# Altium schematic sheet main.SchDoc
size C; SheetNumber: 1; SheetTotal: 1
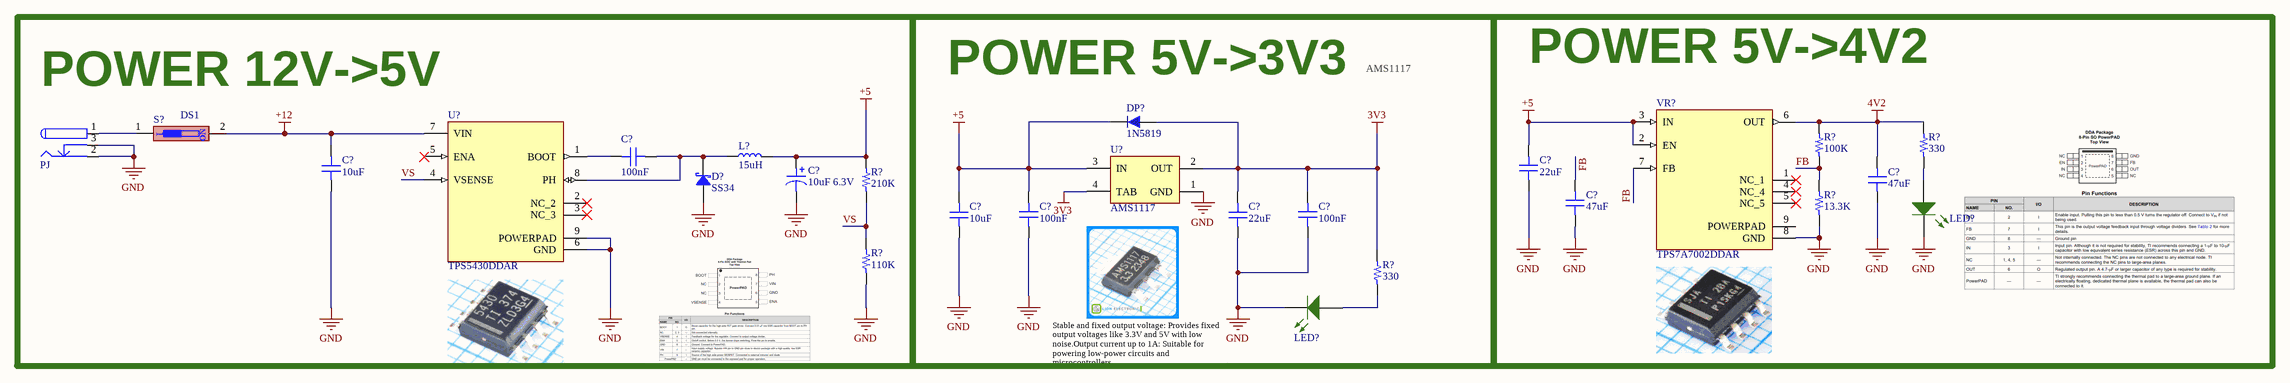
[diagram p0: main.SchDoc]

## Parts
(Parts that share a designator on the sheet are numbered #1, #2 ... from top to bottom, then left to right.)
C?#1  100nF  [CAP 0805_2012]
C?#2  10uF  [CAP 0805_2012]
C?#3  22uF  [CAP 0805_2012]
C?#4  10uF 6.3V  [CAP ALSMD POLY 8.3MM H12.0MM]
C?#5  47uF  [CAP 0805_2012]
C?#6  47uF  [CAP 0805_2012]
C?#7  10uF  [CAP 0805_2012]
C?#8  100nF  [CAP 0805_2012]
C?#9  22uF  [CAP 0805_2012]
C?#10  100nF  [CAP 0805_2012]
D?  SS34  [DO-214AC SMA]
DP?  1N5819  [430X270D]
L?  15uH  [IND 12X12MM]
LED?#1  LED SMD 0805 GREEN  [LED_0805_GREEN]  (value not drawn)
LED?#2  LED SMD 0805 GREEN  [LED_0805_GREEN]  (value not drawn)
PJ  DC Power Jack  [DC Power Jack 1]  (value not drawn)
R?#1  100K  [RES 0805_2012]
R?#2  330  [RES 0805_2012]
R?#3  210K  [RES 0805_2012]
R?#4  13.3K  [RES 0805_2012]
R?#5  110K  [RES 0805_2012]
R?#6  330  [RES 0805_2012]
S?  DS1  [DIP Switch x1]
U?#1  AMS1117  [SOT223_M]
U?#2  TPS5430DDAR  [CONV_TPS5430DDAR]
VR?  TPS7A7002DDAR  [VREG_TPS7A7002DDAR]

## Blocks framed on the sheet
POWER 12V->5V: C?#1 C?#2 C?#4 D? L? PJ R?#3 R?#5 S? U?#2
POWER 5V->3V3: C?#7-C?#10 DP? LED?#2 R?#6 U?#1
POWER 5V->4V2: C?#3 C?#5 C?#6 LED?#1 R?#1 R?#2 R?#4 VR?

## Nets
3V3: C?#9.2 C?#10.1 DP?.1 R?#6.1 U?#1.2(OUT) U?#1.4(TAB)
4V2: C?#5.1 R?#1.1 R?#2.1 VR?.6(OUT)
+5: C?#3.1 C?#4.1 C?#7.2 C?#8.1 DP?.2 L?.2 R?#3.1 U?#1.3(IN) VR?.2(EN) VR?.3(IN)
+12: C?#2.2 S?.2 U?#2.7(VIN)
GND: C?#2.1 C?#3.2 C?#4.2 C?#5.2 C?#6.2 C?#7.1 C?#8.2 C?#9.1 C?#10.2 D?.1 LED?#1.2(K) LED?#2.2(K) PJ.2 PJ.3 R?#4.2 R?#5.2 U?#1.1(GND) U?#2.6(GND) U?#2.9(POWERPAD) VR?.8(GND)
FB: C?#6.1 R?#1.2 R?#4.1 VR?.7(FB)
VS: R?#3.2 R?#5.1 U?#2.4(VSENSE)
NetC?#1_1: C?#1.1 D?.2 L?.1 U?#2.8(PH)
NetC?#1_2: C?#1.2 U?#2.1(BOOT)
NetLED?#1_1: LED?#1.1(A) R?#2.2
NetLED?#2_1: LED?#2.1(A) R?#6.2
NetPJ_1: PJ.1 S?.1

Not connected (* = marked no-connect by the designer): U?#2 2(NC_2)* 3(NC_3)* 5(ENA)*; VR? 1(NC_1)* 4(NC_4)* 5(NC_5)* 9(POWERPAD)

## Notes on the sheet
- AMS1117
- Stable and fixed output voltage: Provides fixed output voltages like 3.3V and 5V with low noise.Output current up to 1A: Suitable for powering low-power circuits and microcontrollers.
- (in symbol DIP Switch 1) ON

## Library data of the parts
C?#1 C?#8 C?#10 = Cap 0805: SMT Capacitor; VALUE: 100nF
C?#2 C?#3 C?#5-C?#7 C?#9 = Cap 0805: SMT Capacitor; VALUE: 100nF
C?#4 = Cap Alu SMD 8.3mm H12.0mm: SMT Aluminum Polymer Capacitor; VALUE: 10uF 6.3V
D? = SS36 (SMD SMA): Diode Schottky 60V 3A Surface Mount DO-214AC (SMA); PartNumber: SS36-HF
DP? = 1N5819: Schottkey Rectifiers; Designer: Abbas Basereh; Data: 16-12-2016; Link: *; Part. No: *
L? = Ind POWER 12X12mm (SMD): SMT Inductor; Value: 15uH
PJ = DC Power Jack: DC Power Jack. Center Pin 2.5mm. Diameter: 5.7mm; Designer: Ali Hafizi; Company: Personal; Project Name: Laser; Adding Date: 10/21/2009
R?#1-R?#6 = Res 0805: SMT Resistor; VALUE: 1K
S? = DIP Switch 1: 1 BIT DIP Switch
U?#1 = AMS1117-x.x: x.x Volt, 800mA Low-Dropout Linear Regulator, 4-pin SOT-223; Designer: Ali Hafizi; Data: 16-12-2016
U?#2 = TPS5430DDAR: 5.5V to 36V Input, 3A, 500kHz Step-Down Converter; MF: Texas Instruments; Package: HSOIC-8 Texas Instruments; Check_prices: https://www.snapeda.com/parts/TPS5430DDAR/Texas+Instruments/view-part/?ref=eda; Value: *; Purchase-URL: https://pricing.snapeda.com/search/part/TPS5430DDAR/?ref=eda; Availability: In Stock; SnapEDA_Link: https://www.snapeda.com/parts/TPS5430DDAR/Texas+Instruments/view-part/?ref=snap; MP: TPS5430DDAR; Price: None
VR? = TPS7A7002DDAR: 3-A, low-VIN (1.4-V), adjustable ultra-low-dropout voltage regulator with enable 8-SO PowerPAD -40 to 125; MF: Texas Instruments; Value: *; Check_prices: https://www.snapeda.com/parts/TPS7A7002DDAR/Texas%20Instruments/view-part/1133879/?ref=eda; Package: HSOIC-8 Texas Instruments; MP: TPS7A7002DDAR; SnapEDA_Link: https://www.snapeda.com/parts/TPS7A7002DDAR/Texas%20Instruments/view-part/1133879/?ref=snap; Purchase-URL: https://pricing.snapeda.com/search/part/TPS7A7002DDAR/?ref=eda; Digi-Key_Part_Number: 296-40977-1-ND